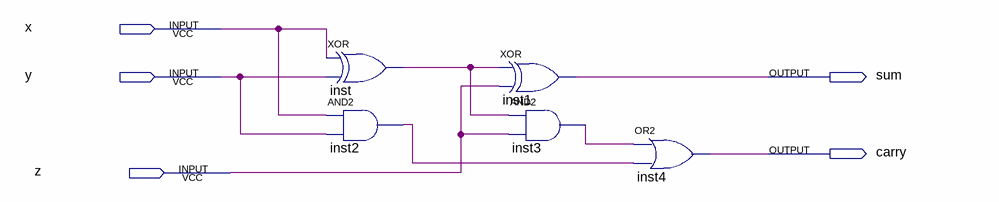
[diagram p0: schematic sheet]
// Quartus schematic FullAdder.bdf as structural Verilog: 5 symbols, 5 pins
module FullAdder (
  input  x,
  input  y,
  input  z,
  output sum,
  output carry
);

  wire inst2_out, inst3_out, inst_out;

  xor inst (inst_out, x, y);
  and inst2 (inst2_out, x, y);
  xor inst1 (sum, inst_out, z);
  and inst3 (inst3_out, inst_out, z);
  or inst4 (carry, inst3_out, inst2_out);
endmodule
